# EasyEDA Pro project Led strip project Schematic &PCB.eprj, schematic Schematic1
Create Date: 2023-09-11; Page Name: P1; Project Name: Atlas Magnetics Move detection; Schematic Name: Schematic1; Update Date: 2023-11-01; Company: EasyEDA.com; Drawed: EasyEDA Pro; Page Size: A4; Part Number: JLCPCB-002; Reviewed: EasyEDA Pro; Version: V0.1
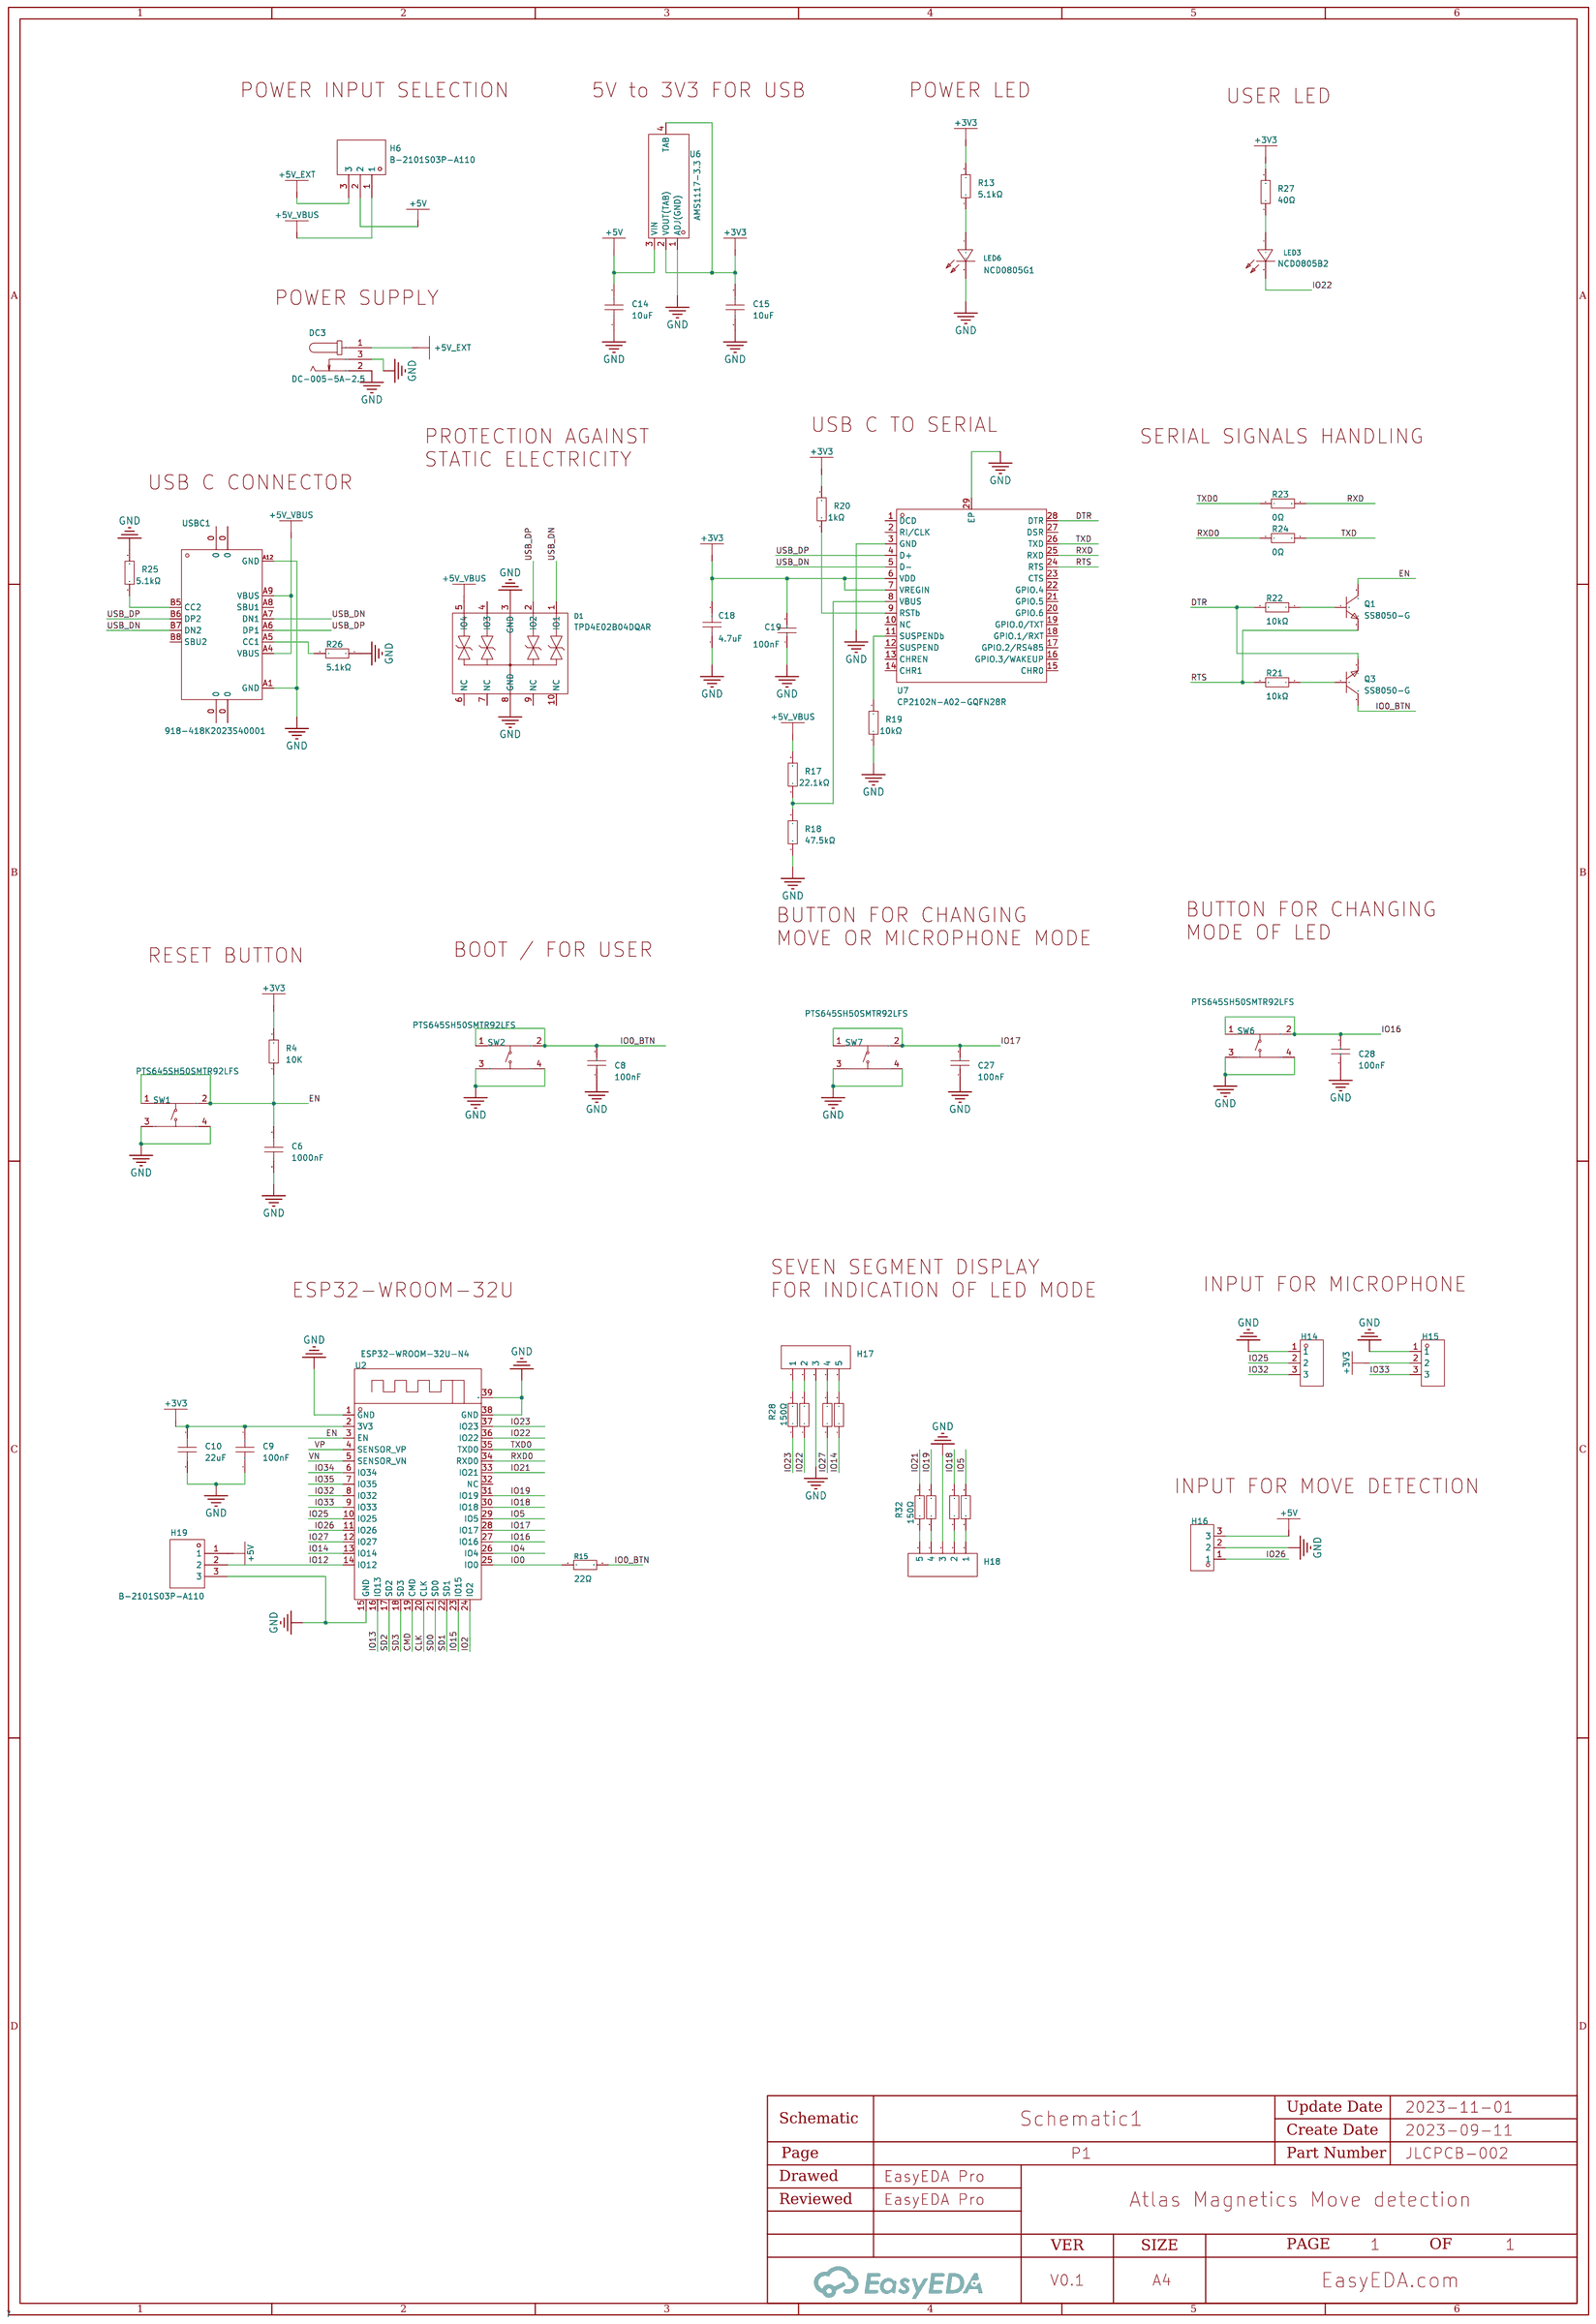
[diagram p0: schematic sheet]

## Parts
C6  1000nF  [C0201]
C8  100nF  [C0402]
C9  100nF  [C0805]
C10  22uF  [C0402]
C14  10uF  [C0805]
C15  10uF  [C0805]
C18  4.7uF  [C0805]
C19  100nF  [C0402]
C27  100nF  [C0402]
C28  100nF  [C0402]
D1  TPD4E02B04DQAR  [USON-10_L2.5-W1.0-P0.50-BL]
DC3  DC-005-5A-2.5  [DC-IN-TH_DC-005-5A-2.5]
H6  B-2101S03P-A110  [HDR-TH_3P-P1.27-V-M-1]
H14  -  [HDR-TH_3P-P2.54-V-F]
H15  -  [HDR-TH_3P-P2.54-V-F]
H16  -  [HDR-TH_3P-P2.54-V-F]
H17  -  [HDR-TH_5P-P2.54-V-F]
H18  -  [HDR-TH_5P-P2.54-V-F]
H19  B-2101S03P-A110  [HDR-TH_3P-P1.27-V-M-1]
LED3  NCD0805B2  [LED0805-R-RD]
LED6  NCD0805G1  [LED0805-R-RD]
Q1  SS8050-G  [SOT-23-3_L2.9-W1.6-P1.90-LS2.8-BR]
Q3  SS8050-G  [SOT-23-3_L2.9-W1.6-P1.90-LS2.8-BR]
R4  10K  [R0201]
R13  5.1kΩ  [R0402]
R15  22Ω  [R0402]
R17  22.1kΩ  [R0402]
R18  47.5kΩ  [R0402]
R19  10kΩ  [R0402]
R20  1kΩ  [R0402]
R21  10kΩ  [R0402]
R22  10kΩ  [R0402]
R23  0Ω  [R0402]
R24  0Ω  [R0402]
R25  5.1kΩ  [R0402]
R26  5.1kΩ  [R0402]
R27  40Ω  [R0402]
R28  150Ω  [R0402]
R29  150Ω  [R0402]
R30  150Ω  [R0402]
R31  150Ω  [R0402]
R32  150Ω  [R0402]
R33  150Ω  [R0402]
R34  150Ω  [R0402]
R35  150Ω  [R0402]
SW1  PTS645SH50SMTR92LFS  [KEY-SMD_4P-L6.0-W6.0-P4.50-LS9.0]
SW2  PTS645SH50SMTR92LFS  [KEY-SMD_4P-L6.0-W6.0-P4.50-LS9.0]
SW6  PTS645SH50SMTR92LFS  [KEY-SMD_4P-L6.0-W6.0-P4.50-LS9.0]
SW7  PTS645SH50SMTR92LFS  [KEY-SMD_4P-L6.0-W6.0-P4.50-LS9.0]
U2  ESP32-WROOM-32U-N4  [WIFIM-SMD_38P-L19.2-W18.0-P1.27]
U6  AMS1117-3.3  [SOT-223-4_L6.5-W3.5-P2.30-LS7.0-BR]
U7  CP2102N-A02-GQFN28R  [QFN-28_L5.0-W5.0-P0.50-TL-EP3.3]
USBC1  918-418K2023S40001  [USB-C-SMD_TYPE-C-USB-17]

## Library data of the parts
C6 = CAP_0201: Supplier Footprint: 0201
C8 C19 C27 C28 = CL05B104KO5NNNC: Capacitance: Tolerance:±10% Tolerance:±10% Voltage Rated: Temperature Coefficient:; LCSC Part Name: 100nF ±10% 16V; Supplier Part: C1525; Manufacturer: SAMSUNG(三星); Supplier Footprint: 0402; JLCPCB Part Class: Basic Part; Datasheet: https://atta.szlcsc.com/upload/public/pdf/source/20160103/1457707674891.pdf; Supplier: LCSC; Tolerance: ±10%
C9 C14 C15 C18 = CL21A226MAYNNNE: Capacitance: Tolerance:±20% Tolerance:±20% Voltage Rated: Temperature Coefficient:; LCSC Part Name: 22uF ±20% 25V; Supplier Part: C602037; Manufacturer: SAMSUNG(三星); Supplier Footprint: 0805; JLCPCB Part Class: Extended Part; Datasheet: https://atta.szlcsc.com/upload/public/pdf/source/20200609/C602037_1A0D619693E608A1BF6E80154254E2DB.pdf; Supplier: LCSC; Tolerance: ±20%
C10 = CL05A106MP5NUNC_C315248: Capacitance: Tolerance:±20% Tolerance:±20% Voltage Rated: Temperature Coefficient:; LCSC Part Name: 10uF ±20% 10V; Supplier Part: C315248; Manufacturer: SAMSUNG(三星); Manufacturer Part: CL05A106MP5NUNC; Supplier Footprint: 0402; JLCPCB Part Class: Extended Part; Datasheet: https://atta.szlcsc.com/upload/public/pdf/source/20200102/C478861_C4302703595930F3C0E62DAD3349F1AA.pdf; Supplier: LCSC; Tolerance: ±20%
D1 = TPD4E02B04DQAR: Polarity:Bi-Directional Reverse Stand-Off Voltage (Vrwm):3.6V Breakdown Voltage (VBR):5.5V Peak Pulse Current(Ipp)@8/20us:5A Clamping Voltage@Ipp:8.8V Peak Pulse Power(Ppp)@8/20us:17W Junction Capacitance(Cj)@1MHz:0.27pF@1MHz Operating Temperature:-40℃~+1; LCSC Part Name: 双向ESD; Supplier Part: C106794; Manufacturer: TI(德州仪器); Supplier Footprint: DFN-10(1x2.5); JLCPCB Part Class: Extended Part; Datasheet: https://www.ti.com/cn/lit/gpn/tpd4e02b04; Supplier: LCSC; Polarity: Bi-Directional; Reverse Stand-Off Voltage (Vrwm): 3.6V; Breakdown Voltage (VBR): 5.5V; Peak Pulse Current(Ipp)@8/20us: 5A; Clamping Voltage@Ipp: 8.8V; Peak Pulse Power(Ppp)@8/20us: 17W; Junction Capacitance(Cj)@1MHz: 0.27pF@1MHz; Operating Temperature: -40℃~+125℃@(Ta)
DC3 = DC-005-5A-2.5: Connector Type:DC Power Receptacle Inside Contact Diameter:2.5mm Outside Contact Diameter:6.5mm Current Rating (Max):5A Voltage Rating (Max):24V Contact Material:Brass Operating Temperature Range:-20℃~+70℃ Operating Temperature Range:-20℃~+70℃ Welding Tem; LCSC Part Name: DC电源插座 内径:2.5mm 外径:6.5mm; Supplier Part: C381115; Manufacturer: XKB Connectivity(中国星坤); Supplier Footprint: 插件; JLCPCB Part Class: Extended Part; Datasheet: https://atta.szlcsc.com/upload/public/pdf/source/20220930/9F6B678D272419D8FE16D336E354A545.pdf; Supplier: LCSC; Connector Type: DC Power Receptacle; Inside Contact Diameter: 2.5mm; Outside Contact Diameter: 6.5mm; Current Rating (Max): 5A; Voltage Rating (Max): 24V; Contact Material: Brass; Operating Temperature Range: -20℃~+70℃; Welding Temperature (Max): 260℃
H6 H19 = B-2101S03P-A110: Number of Rows:Plugin Number of Pins:3P Pitch:1.27mm Pin Structure:1x3P Row Spacing:- Mounting Type:Straight Circluar Pins/Square Pins:- Current Rating (Max):- Voltage Rating (Max):- Length of Mating Pin:3mm Insulation Height:1mm Length of End Connection; LCSC Part Name: 1.27mm 1x3P 直插; Supplier Part: C124354; Manufacturer: Ckmtw(灿科盟); Supplier Footprint: 插件,P=1.27mm; JLCPCB Part Class: Extended Part; Datasheet: https://atta.szlcsc.com/upload/public/pdf/source/20180111/C168959_15156386212551255514.pdf; Supplier: LCSC; Number of Rows: Plugin; Number of Pins: 3P; Pitch: 1.27mm; Pin Structure: 1x3P; Mounting Type: Straight; Length of Mating Pin: 3mm; Insulation Height: 1mm; Length of End Connection Pin: 1.8mm; Operating Temperature Range: -40℃~+105℃; Color: Black
H14-H16 = HDR-F_2.54_1x3P: Supplier Footprint: Through
H17 H18 = HDR-F_2.54_1x5P: Supplier Footprint: Through
LED3 = NCD0805B2: Emitted Color:blue; LCSC Part Name: 蓝灯 0805蓝灯   正贴; Supplier Part: C84259; Manufacturer: 国星光电; Supplier Footprint: 0805; JLCPCB Part Class: Extended Part; Datasheet: https://atta.szlcsc.com/upload/public/pdf/source/20200820/C84259_E5AC6865415989C4C2C2831134BA3A23.pdf; Supplier: LCSC; Emitted Color: blue
LED6 = NCD0805G1: Emitted Color:Emerald; LCSC Part Name: 翠绿 0805翠绿  正贴; Supplier Part: C84260; Manufacturer: 国星光电; Supplier Footprint: 0805; JLCPCB Part Class: Extended Part; Datasheet: https://atta.szlcsc.com/upload/public/pdf/source/20200820/C84260_AFC7BF57C6FBA034D182BB8D10A67EFE.pdf; Supplier: LCSC; Emitted Color: Emerald
Q1 Q3 = SS8050-G_C164886: Transistor Type: Collector-Emitter Breakdown Voltage (Vceo): Collector Current (Ic): Power Dissipation (Pd): Collector Cut-Off Current (Icbo):100nA Collector-Emitter Saturation Voltage (VCE(sat)@Ic,Ib):500mV@800mA,80mA DC Current Gain (hFE@Ic,Vce):120@100; LCSC Part Name: NPN 25V 1.5A L档(120-200); Supplier Part: C164886; Manufacturer: CJ(江苏长电/长晶); Supplier Footprint: SOT-23; JLCPCB Part Class: Extended Part; Datasheet: https://atta.szlcsc.com/upload/public/pdf/source/20171228/C164886_15144412883891213890.pdf; Supplier: LCSC; Collector Cut-Off Current (Icbo): 100nA; Collector-Emitter Saturation Voltage (VCE(sat)@Ic,Ib): 500mV@800mA,80mA; DC Current Gain (hFE@Ic,Vce): 120@100mA,1V; Transition Frequency (fT): 100MHz; Operating Temperature: +150℃@(Tj)
R4 = Res_0201: Supplier Footprint: 0201
R13 R17-R22 R25-R35 = 0402WGF4752TCE: Type:Thick Film Resistors Resistance: Tolerance:±1% Tolerance:±1% Power(Watts): Temperature Coefficient:±100ppm/℃ Temperature Coefficient:±100ppm/℃ Overload Voltage (Max): Operating Temperature Range:-55℃~+155℃ Operating Temperature Range:-55℃~+155℃; LCSC Part Name: 47.5kΩ ±1% 62.5mW; Supplier Part: C25896; Manufacturer: UNI-ROYAL(厚声); Supplier Footprint: 0402; JLCPCB Part Class: Extended Part; Datasheet: https://atta.szlcsc.com/upload/public/pdf/source/20200306/C422600_1E6D84923E4A46A82E41ADD87F860B5C.pdf; Supplier: LCSC; Type: Thick Film Resistors; Tolerance: ±1%; Temperature Coefficient: ±100ppm/℃; Operating Temperature Range: -55℃~+155℃
R15 = 0402WGF220JTCE: Type:Thick Film Resistors Resistance: Tolerance:±1% Tolerance:±1% Power(Watts): Temperature Coefficient:±100ppm/℃ Temperature Coefficient:±100ppm/℃ Overload Voltage (Max): Operating Temperature Range:-55℃~+155℃ Operating Temperature Range:-55℃~+155℃; LCSC Part Name: 厚膜电阻 22Ω ±1% 62.5mW; Supplier Part: C25092; Manufacturer: UNI-ROYAL(厚声); Supplier Footprint: 0402; JLCPCB Part Class: Basic Part; Datasheet: https://atta.szlcsc.com/upload/public/pdf/source/20200306/C422600_1E6D84923E4A46A82E41ADD87F860B5C.pdf; Supplier: LCSC; Type: Thick Film Resistors; Tolerance: ±1%; Temperature Coefficient: ±100ppm/℃; Operating Temperature Range: -55℃~+155℃
R23 R24 = 0402WGF0000TCE: Type:Thick Film Resistors Resistance: Tolerance:±1% Tolerance:±1% Power(Watts): Temperature Coefficient:±800ppm/℃ Temperature Coefficient:±800ppm/℃ Overload Voltage (Max): Operating Temperature Range:-55℃~+155℃ Operating Temperature Range:-55℃~+155℃; LCSC Part Name: 0Ω ±1% 62.5mW; Supplier Part: C17168; Manufacturer: UNI-ROYAL(厚声); Supplier Footprint: 0402; JLCPCB Part Class: Basic Part; Datasheet: https://atta.szlcsc.com/upload/public/pdf/source/20200306/C422600_1E6D84923E4A46A82E41ADD87F860B5C.pdf; Supplier: LCSC; Type: Thick Film Resistors; Tolerance: ±1%; Temperature Coefficient: ±800ppm/℃; Operating Temperature Range: -55℃~+155℃
SW1 SW2 SW6 SW7 = PTS645SH50SMTR92LFS: Contact Current:50mA Voltage Rating (DC):12V Circuit:SPST Mounting Style:Brick nogging Actuator Style:Round Button With Lamp:- Mechanical Life:- Switch Length:6mm Switch Width:6mm Switch Height:5mm; Supplier Part: C221869; Manufacturer: C&K; Supplier Footprint: SMD,6x6mm; JLCPCB Part Class: Extended Part; Datasheet: https://atta.szlcsc.com/upload/public/pdf/source/20180724/C221869_A3CD8F88243A0C9F593A654E7151468B.pdf; Supplier: LCSC; Contact Current: 50mA; Voltage Rating (DC): 12V; Circuit: SPST; Mounting Style: Brick nogging; Actuator Style: Round Button; Switch Length: 6mm; Switch Width: 6mm; Switch Height: 5mm
U2 = ESP32-WROOM-32U-N4_C328062: LCSC Part Name: 通用型Wi-Fi+BT+BLEMCU模组 (4MB); Supplier Part: C328062; Manufacturer: ESPRESSIF(乐鑫); Supplier Footprint: SMD,18x19.2mm; JLCPCB Part Class: Extended Part; Datasheet: https://atta.szlcsc.com/upload/public/pdf/source/20191226/C328062_B9CC590A182A41F9F993184C790842FE.pdf; Supplier: LCSC
U6 = AMS1117-3.3_C347222: Output Type: Output Polarity:Positive Number of Outputs:1 Maximum Input Voltage:18V Output Voltage:3.3V~3.3V Output Voltage:3.3V~3.3V Dropout Voltage:1.3V@(1A) Output Current:1A Power Supply Rejection Ratio (PSRR):60dB@(120Hz); Supplier Part: C347222; Manufacturer: UMW(广东友台半导体); Supplier Footprint: SOT-223; JLCPCB Part Class: Extended Part; Datasheet: https://atta.szlcsc.com/upload/public/pdf/source/20211011/50CC665C22E3A66C08379A4A74BDA25C.pdf; Supplier: LCSC; Output Polarity: Positive; Number of Outputs: 1; Maximum Input Voltage: 18V; Output Voltage: 3.3V~3.3V; Dropout Voltage: 1.3V@(1A); Output Current: 1A; Power Supply Rejection Ratio (PSRR): 60dB@(120Hz)
U7 = CP2102N-A02-GQFN28R: Type: Protocol: Number of Drivers/Receivers: Data Rate: Supply Voltage:; Supplier Part: C964632; Manufacturer: SILICON LABS(芯科); Supplier Footprint: QFN-28; JLCPCB Part Class: Extended Part; Datasheet: https://atta.szlcsc.com/upload/public/pdf/source/20201204/C964632_F2B790CC23A72455AEF523510305B30A.pdf; Supplier: LCSC
USBC1 = 918-418K2023S40001: Connector Type:Type-C Standard:- Gender:Female Number of Contacts:16P Number of Ports:1 Current Rating - Power (Max):3A; LCSC Part Name: Type-C 母座; Supplier Part: C167321; Manufacturer: 精拓金; Supplier Footprint: SMD; JLCPCB Part Class: Extended Part; Datasheet: https://atta.szlcsc.com/upload/public/pdf/source/20210305/C167321_3BB79E85CEB6874BF587E64926D16F83.pdf; Supplier: LCSC; Connector Type: Type-C; Gender: Female; Number of Contacts: 16P; Number of Ports: 1; Current Rating - Power (Max): 3A

## Nets
+3V3: C9.1 C10.1 C15.2 C18.2 C19.2 H15.2 R4.2 R13.2 R20.2 R27.2 U2.2(3V3) U6.2(VOUT(TAB)) U6.4(TAB) U7.6(VDD) U7.7(VREGIN)
+5V: C14.2 H6.2 H16.3 H19.1 U6.3(VIN)
+5V_EXT: DC3.1 H6.3
+5V_VBUS: D1.5(IO4) H6.1 R17.2 USBC1.A4(VBUS) USBC1.A9(VBUS)
GND: C6.2 C8.1 C9.2 C10.2 C14.1 C15.1 C18.1 C19.1 C27.1 C28.1 D1.3(GND) D1.8(GND) DC3.2 DC3.3 H14.1 H15.1 H16.2 H17.3 H18.3 H19.3 LED6.2(K) R18.1 R19.1 R25.2 R26.1 SW1.3 SW1.4 SW2.3 SW2.4 SW6.3 SW6.4 SW7.3 SW7.4 U2.1(GND) U2.15(GND) U2.38(GND) U2.39(GND) U6.1(ADJ(GND)) U7.3(GND) U7.29(EP) USBC1.A1(GND) USBC1.A12(GND)
CLK: U2.20(CLK)
CMD: U2.19(CMD)
DTR: Q3.2(E) R22.2 U7.28(DTR)
EN: C6.1 Q1.3(C) R4.1 SW1.1 SW1.2 U2.3(EN)
IO0: R15.1 U2.25(IO0)
IO0_BTN: C8.2 Q3.3(C) R15.2 SW2.1 SW2.2
IO2: U2.24(IO2)
IO4: U2.26(IO4)
IO5: R34.2 U2.29(IO5)
IO12: H19.2 U2.14(IO12)
IO13: U2.16(IO13)
IO14: R35.1 U2.13(IO14)
IO15: U2.23(IO15)
IO16: C28.2 SW6.1 SW6.2 U2.27(IO16)
IO17: C27.2 SW7.1 SW7.2 U2.28(IO17)
IO18: R33.2 U2.30(IO18)
IO19: R31.2 U2.31(IO19)
IO21: R32.2 U2.33(IO21)
IO22: LED3.2(-) R29.1 U2.36(IO22)
IO23: R28.1 U2.37(IO23)
IO25: H14.2 U2.10(IO25)
IO26: H16.1 U2.11(IO26)
IO27: R30.1 U2.12(IO27)
IO32: H14.3 U2.8(IO32)
IO33: H15.3 U2.9(IO33)
IO34: U2.6(IO34)
IO35: U2.7(IO35)
RTS: Q1.2(E) R21.2 U7.24(RTS)
RXD: R23.2 U7.25(RXD)
RXD0: R24.1 U2.34(RXD0)
SD0: U2.21(SD0)
SD1: U2.22(SD1)
SD2: U2.17(SD2)
SD3: U2.18(SD3)
TXD: R24.2 U7.26(TXD)
TXD0: R23.1 U2.35(TXD0)
USB_DN: D1.1(IO1) U7.5(D-) USBC1.A7(DN1) USBC1.B7(DN2)
USB_DP: D1.2(IO2) U7.4(D+) USBC1.A6(DP1) USBC1.B6(DP2)
VN: U2.5(SENSOR_VN)
VP: U2.4(SENSOR_VP)
$1N5917: LED6.1(A) R13.1
$1N7816: LED3.1(+) R27.1
$1N15613: R17.1 R18.2 U7.8(VBUS)
$1N15669: R19.2 U7.11(SUSPENDb)
$1N15732: R20.1 U7.9(RSTb)
$1N16147: Q1.1(B) R22.1
$1N16150: Q3.1(B) R21.1
$1N31082: R25.1 USBC1.B5(CC2)
$1N31086: R26.2 USBC1.A5(CC1)
$1N35428: H17.1 R28.2
$1N35434: H17.2 R29.2
$1N35441: H18.5 R32.1
$1N35448: H18.4 R31.1
$1N35465: H17.4 R30.2
$1N35471: H17.5 R35.2
$1N35478: H18.2 R33.1
$1N35484: H18.1 R34.1

Not connected (* = marked no-connect by the designer): D1 4(IO3) 6(NC) 7(NC) 9(NC) 10(NC); U2 32(NC); U7 1(DCD) 2(RI/CLK) 10(NC) 12(SUSPEND) 13(CHREN) 14(CHR1) 15(CHR0) 16(GPIO.3/WAKEUP) 17(GPIO.2/RS485) 18(GPIO.1/RXT) 19(GPIO.0/TXT) 20(GPIO.6) 21(GPIO.5) 22(GPIO.4) 23(CTS) 27(DSR); USBC1 0 A8(SBU1) B8(SBU2)

## Notes on the sheet
- POWER INPUT SELECTION
- 5V to 3V3 FOR USB
- POWER LED
- USER LED
- POWER SUPPLY
- USB C TO SERIAL
- SERIAL SIGNALS HANDLING
- PROTECTION AGAINST
  STATIC ELECTRICITY
- USB C CONNECTOR
- BUTTON FOR CHANGING
  MOVE OR MICROPHONE MODE
- BUTTON FOR CHANGING
  MODE OF LED
- RESET BUTTON
- BOOT / FOR USER
- INPUT FOR MICROPHONE
- ESP32-WROOM-32U
- SEVEN SEGMENT DISPLAY
  FOR INDICATION OF LED MODE
- INPUT FOR MOVE DETECTION
